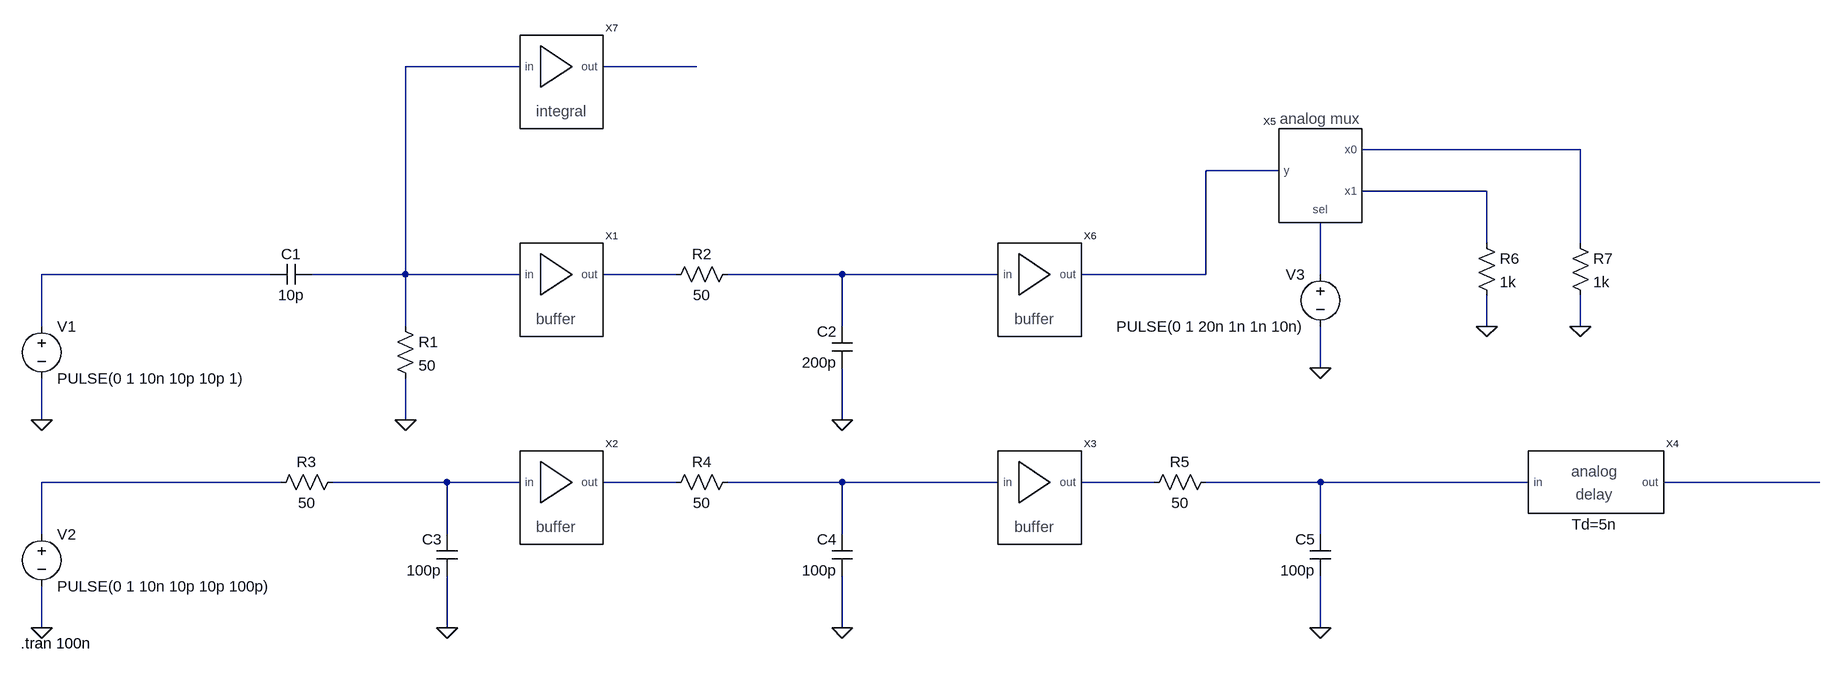
[diagram p0: schematic demo.asc]
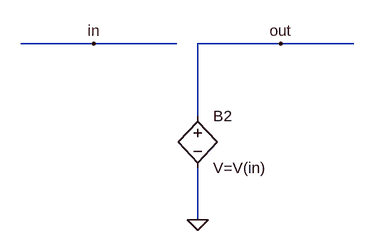
[diagram p1: sub-circuit ideal_buffer.asc]
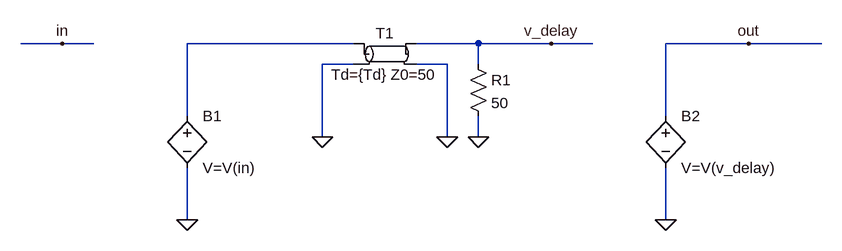
[diagram p2: sub-circuit analog_delay.asc]
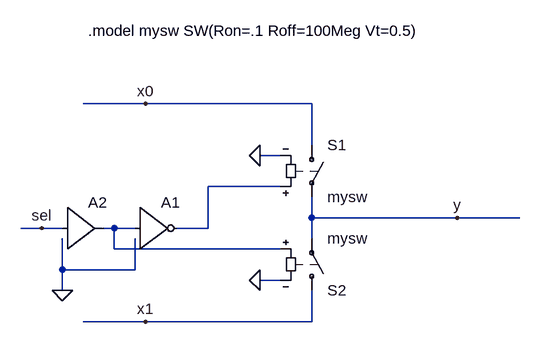
[diagram p3: sub-circuit ideal_amux.asc]
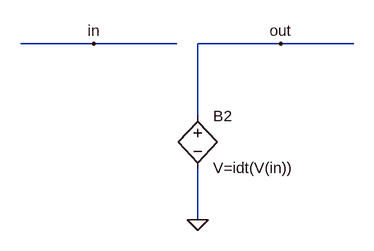
[diagram p4: sub-circuit ideal_int.asc]
demo.asc, the LTspice schematic file:
Version 4
SHEET 1 2756 696
WIRE 752 -208 576 -208
WIRE 1024 -208 880 -208
WIRE 2384 -80 2048 -80
WIRE 1920 -48 1808 -48
WIRE 2240 -16 2048 -16
WIRE 2240 64 2240 -16
WIRE 2384 64 2384 -80
WIRE 368 112 16 112
WIRE 576 112 576 -208
WIRE 576 112 432 112
WIRE 752 112 576 112
WIRE 992 112 880 112
WIRE 1248 112 1072 112
WIRE 1488 112 1248 112
WIRE 1808 112 1808 -48
WIRE 1808 112 1616 112
WIRE 1984 112 1984 32
WIRE 16 192 16 112
WIRE 576 192 576 112
WIRE 1248 192 1248 112
WIRE 2240 192 2240 144
WIRE 2384 192 2384 144
WIRE 1984 256 1984 192
WIRE 16 336 16 272
WIRE 576 336 576 272
WIRE 1248 336 1248 256
WIRE 384 432 16 432
WIRE 640 432 464 432
WIRE 752 432 640 432
WIRE 992 432 880 432
WIRE 1248 432 1072 432
WIRE 1488 432 1248 432
WIRE 1728 432 1616 432
WIRE 1984 432 1808 432
WIRE 2304 432 1984 432
WIRE 2752 432 2512 432
WIRE 16 512 16 432
WIRE 640 512 640 432
WIRE 1248 512 1248 432
WIRE 1984 512 1984 432
WIRE 16 656 16 592
WIRE 640 656 640 576
WIRE 1248 656 1248 576
WIRE 1984 656 1984 576
FLAG 16 336 0
FLAG 576 336 0
FLAG 1248 336 0
FLAG 16 656 0
FLAG 1248 656 0
FLAG 640 656 0
FLAG 1984 656 0
FLAG 1984 256 0
FLAG 2240 192 0
FLAG 2384 192 0
SYMBOL voltage 16 176 R0
WINDOW 123 0 0 Left 0
WINDOW 39 0 0 Left 0
SYMATTR InstName V1
SYMATTR Value PULSE(0 1 10n 10p 10p 1)
SYMBOL cap 432 96 R90
WINDOW 0 0 32 VBottom 2
WINDOW 3 32 32 VTop 2
SYMATTR InstName C1
SYMATTR Value 10p
SYMBOL res 560 176 R0
SYMATTR InstName R1
SYMATTR Value 50
SYMBOL ideal_buffer 816 112 R0
SYMATTR InstName X1
SYMBOL res 1088 96 R90
WINDOW 0 0 56 VBottom 2
WINDOW 3 32 56 VTop 2
SYMATTR InstName R2
SYMATTR Value 50
SYMBOL cap 1264 256 R180
WINDOW 0 24 56 Left 2
WINDOW 3 24 8 Left 2
SYMATTR InstName C2
SYMATTR Value 200p
SYMBOL voltage 16 496 R0
WINDOW 123 0 0 Left 0
WINDOW 39 0 0 Left 0
SYMATTR InstName V2
SYMATTR Value PULSE(0 1 10n 10p 10p 100p)
SYMBOL res 1088 416 R90
WINDOW 0 0 56 VBottom 2
WINDOW 3 32 56 VTop 2
SYMATTR InstName R4
SYMATTR Value 50
SYMBOL cap 1264 576 R180
WINDOW 0 24 56 Left 2
WINDOW 3 24 8 Left 2
SYMATTR InstName C4
SYMATTR Value 100p
SYMBOL res 480 416 R90
WINDOW 0 0 56 VBottom 2
WINDOW 3 32 56 VTop 2
SYMATTR InstName R3
SYMATTR Value 50
SYMBOL cap 656 576 R180
WINDOW 0 24 56 Left 2
WINDOW 3 24 8 Left 2
SYMATTR InstName C3
SYMATTR Value 100p
SYMBOL ideal_buffer 816 432 R0
SYMATTR InstName X2
SYMBOL res 1824 416 R90
WINDOW 0 0 56 VBottom 2
WINDOW 3 32 56 VTop 2
SYMATTR InstName R5
SYMATTR Value 50
SYMBOL cap 2000 576 R180
WINDOW 0 24 56 Left 2
WINDOW 3 24 8 Left 2
SYMATTR InstName C5
SYMATTR Value 100p
SYMBOL ideal_buffer 1552 432 R0
SYMATTR InstName X3
SYMBOL analog_delay 2400 432 R0
SYMATTR InstName X4
SYMBOL ideal_amux 1984 -64 M0
SYMATTR InstName X5
SYMBOL voltage 1984 96 M0
WINDOW 123 0 0 Left 0
WINDOW 39 0 0 Left 0
SYMATTR InstName V3
SYMATTR Value PULSE(0 1 20n 1n 1n 10n)
SYMBOL ideal_buffer 1552 112 R0
SYMATTR InstName X6
SYMBOL res 2224 48 R0
SYMATTR InstName R6
SYMATTR Value 1k
SYMBOL res 2368 48 R0
SYMATTR InstName R7
SYMATTR Value 1k
SYMBOL ideal_int 816 -208 R0
SYMATTR InstName X7
TEXT -16 680 Left 2 !.tran 100n

ideal_buffer.asc, the sub-circuit schematic file:
Version 4
SHEET 1 2652 680
WIRE 528 32 416 32
WIRE 656 32 528 32
WIRE 816 32 688 32
WIRE 928 32 816 32
WIRE 688 144 688 32
WIRE 688 304 688 224
FLAG 688 304 0
FLAG 528 32 in
FLAG 816 32 out
SYMBOL bv 688 128 R0
SYMATTR InstName B2
SYMATTR Value V=V(in)

analog_delay.asc, the sub-circuit schematic file:
Version 4
SHEET 1 1492 680
WIRE -192 192 -256 192
WIRE -144 192 -192 192
WIRE 256 192 0 192
WIRE 448 192 352 192
WIRE 560 192 448 192
WIRE 624 192 560 192
WIRE 864 192 736 192
WIRE 976 192 864 192
WIRE 256 224 208 224
WIRE 400 224 352 224
WIRE 448 224 448 192
WIRE 0 304 0 192
WIRE 736 304 736 192
WIRE 208 336 208 224
WIRE 400 336 400 224
WIRE 448 336 448 304
WIRE 0 464 0 384
WIRE 736 464 736 384
FLAG -192 192 in
FLAG 400 336 0
FLAG 208 336 0
FLAG 448 336 0
FLAG 0 464 0
FLAG 736 464 0
FLAG 864 192 out
FLAG 560 192 v_delay
SYMBOL res 432 208 R0
SYMATTR InstName R1
SYMATTR Value 50
SYMBOL tline 304 208 R0
SYMATTR InstName T1
SYMATTR Value Td={Td} Z0=50
SYMBOL bv 0 288 R0
SYMATTR InstName B1
SYMATTR Value V=V(in)
SYMBOL bv 736 288 R0
SYMATTR InstName B2
SYMATTR Value V=V(v_delay)

ideal_amux.asc, the sub-circuit schematic file:
Version 4
SHEET 1 2652 680
WIRE 640 -48 544 -48
WIRE 896 -48 640 -48
WIRE 896 16 896 -48
WIRE 848 32 816 32
WIRE 848 80 736 80
WIRE 896 128 896 96
WIRE 1120 128 896 128
WIRE 1216 128 1120 128
WIRE 480 144 448 144
WIRE 512 144 480 144
WIRE 592 144 576 144
WIRE 624 144 592 144
WIRE 736 144 736 80
WIRE 736 144 688 144
WIRE 896 160 896 128
WIRE 592 176 592 144
WIRE 848 176 592 176
WIRE 512 208 512 160
WIRE 624 208 624 160
WIRE 624 208 512 208
WIRE 848 224 816 224
WIRE 512 240 512 208
WIRE 640 288 544 288
WIRE 896 288 896 240
WIRE 896 288 640 288
FLAG 640 -48 x0
FLAG 640 288 x1
FLAG 1120 128 y
FLAG 480 144 sel
FLAG 816 224 0
FLAG 816 32 0
FLAG 512 240 0
SYMBOL sw 896 0 R0
SYMATTR InstName S1
SYMATTR Value mysw
SYMBOL sw 896 256 M180
SYMATTR InstName S2
SYMATTR Value mysw
SYMBOL Digital\\inv 624 80 R0
SYMATTR InstName A1
SYMBOL Digital\\buf1 512 80 R0
SYMATTR InstName A2
TEXT 552 -160 Left 2 !.model mysw SW(Ron=.1 Roff=100Meg Vt=0.5)

ideal_int.asc, the sub-circuit schematic file:
Version 4
SHEET 1 2652 680
WIRE 528 32 416 32
WIRE 656 32 528 32
WIRE 816 32 688 32
WIRE 928 32 816 32
WIRE 688 144 688 32
WIRE 688 304 688 224
FLAG 688 304 0
FLAG 528 32 in
FLAG 816 32 out
SYMBOL bv 688 128 R0
SYMATTR InstName B2
SYMATTR Value V=idt(V(in))

The netlist it stands for:
* demo.asc
V1 N006 0 PULSE(0 1 10n 10p 10p 1)
C1 N001 N006 10p
R1 N001 0 50
XX1 N001 N007 ideal_buffer
R2 N008 N007 50
C2 0 N008 200p
V2 N010 0 PULSE(0 1 10n 10p 10p 100p)
R4 N013 N012 50
C4 0 N013 100p
R3 N011 N010 50
C3 0 N011 100p
XX2 N011 N012 ideal_buffer
R5 N015 N014 50
C5 0 N015 100p
XX3 N013 N014 ideal_buffer
XX4 N015 N016 analog_delay params: Td=5n
XX5 N003 N004 N005 N009 ideal_amux
V3 N009 0 PULSE(0 1 20n 1n 1n 10n)
XX6 N008 N004 ideal_buffer
R6 N005 0 1k
R7 N003 0 1k
XX7 N001 N002 ideal_int

* block symbol definitions
.subckt ideal_buffer in out
B2 out 0 V=V(in)
.ends ideal_buffer

.subckt analog_delay in out
R1 v_delay 0 50
T1 N001 0 v_delay 0 Td={Td} Z0=50
B1 N001 0 V=V(in)
B2 out 0 V=V(v_delay)
.ends analog_delay

.subckt ideal_amux x0 y x1 sel
S1 x0 y N001 0 mysw
S2 x1 y N002 0 mysw
A1 N002 0 0 0 0 N001 0 0 BUF
A2 sel 0 0 0 0 0 N002 0 BUF
.model mysw SW(Ron=.1 Roff=100Meg Vt=0.5)
.ends ideal_amux

.subckt ideal_int in out
B2 out 0 V=idt(V(in))
.ends ideal_int

.tran 100n
.backanno
.end